# Altium schematic sheet IN-OUT.SchDoc
size A4
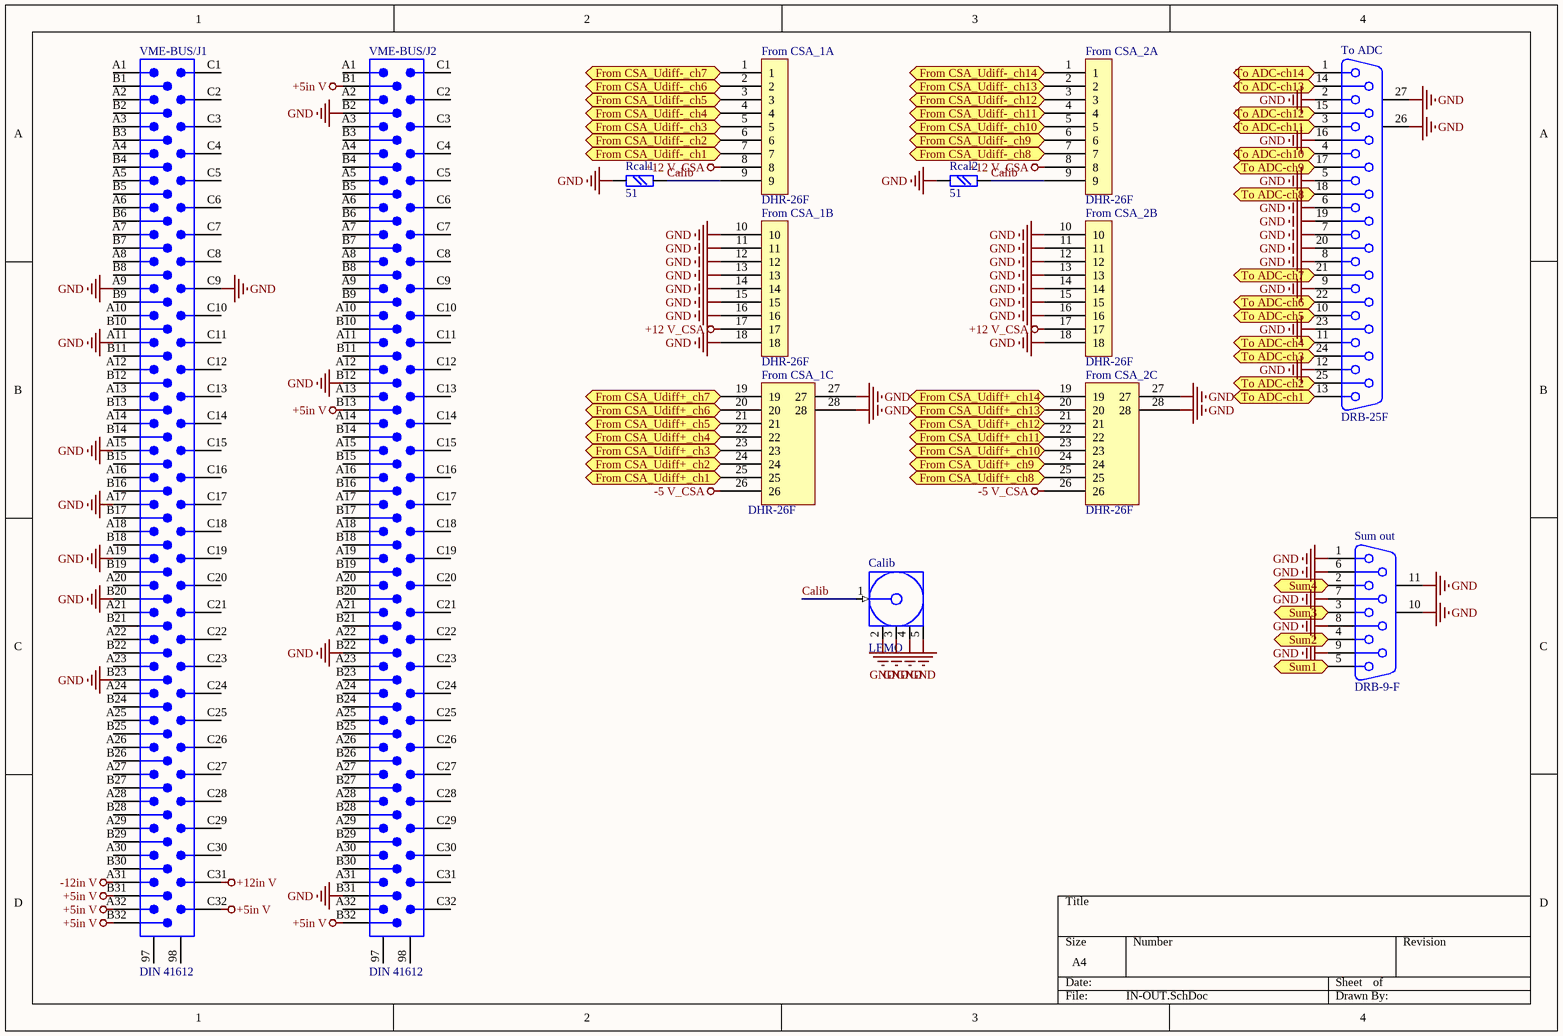
[diagram p0: IN-OUT.SchDoc]

## Parts
Calib  LEMO  [LEMO]
From_CSA_1  DHR-26F  [DHR-F-26]  (parts A,B,C of 3)
From_CSA_2  DHR-26F  [DHR-F-26]  (parts A,B,C of 3)
Rcal1  51  [chip0805]
Rcal2  51  [chip0805]
Sum_out  DRB-9-F  [DSUB1.385-2H9]
To_ADC  DRB-25F  [DSUB1.385-2H25A]
VME-BUS/J1  DIN 41612  [EURO2.54-2H96]
VME-BUS/J2  DIN 41612  [EURO2.54-2H96]

## Ports
From CSA_Udiff+_ch1 (in), From CSA_Udiff+_ch2 (in), From CSA_Udiff+_ch3 (in), From CSA_Udiff+_ch4 (in), From CSA_Udiff+_ch5 (in), From CSA_Udiff+_ch6 (in), From CSA_Udiff+_ch7 (in), From CSA_Udiff+_ch8 (in), From CSA_Udiff+_ch9 (in), From CSA_Udiff+_ch10 (in), From CSA_Udiff+_ch11 (in), From CSA_Udiff+_ch12 (in), From CSA_Udiff+_ch13 (in), From CSA_Udiff+_ch14 (in), From CSA_Udiff-_ch1 (in), From CSA_Udiff-_ch2 (in), From CSA_Udiff-_ch3 (in), From CSA_Udiff-_ch4 (in), From CSA_Udiff-_ch5 (in), From CSA_Udiff-_ch6 (in), From CSA_Udiff-_ch7 (in), From CSA_Udiff-_ch8 (in), From CSA_Udiff-_ch9 (in), From CSA_Udiff-_ch10 (in), From CSA_Udiff-_ch11 (in), From CSA_Udiff-_ch12 (in), From CSA_Udiff-_ch13 (in), From CSA_Udiff-_ch14 (in), Sum1 (in), Sum2 (in), Sum3 (in), Sum4 (in), To ADC-ch1 (in), To ADC-ch2 (in), To ADC-ch3 (in), To ADC-ch4 (in), To ADC-ch5 (in), To ADC-ch6 (in), To ADC-ch7 (in), To ADC-ch8 (in), To ADC-ch9 (in), To ADC-ch10 (in), To ADC-ch11 (in), To ADC-ch12 (in), To ADC-ch13 (in), To ADC-ch14 (in)

## Nets
+5in V: VME-BUS/J1.A32 VME-BUS/J1.B31 VME-BUS/J1.B32 VME-BUS/J1.C32 VME-BUS/J2.B1 VME-BUS/J2.B13 VME-BUS/J2.B32
+12 V_CSA: From_CSA_1.8 From_CSA_1.17 From_CSA_2.8 From_CSA_2.17
+12in V: VME-BUS/J1.C31
-5 V_CSA: From_CSA_1.26 From_CSA_2.26
-12in V: VME-BUS/J1.A31
GND: Calib.2(GND) Calib.3(GND) Calib.4(GND) Calib.5(GND) From_CSA_1.10 From_CSA_1.11 From_CSA_1.12 From_CSA_1.13 From_CSA_1.14 From_CSA_1.15 From_CSA_1.16 From_CSA_1.18 From_CSA_1.27 From_CSA_1.28 From_CSA_2.10 From_CSA_2.11 From_CSA_2.12 From_CSA_2.13 From_CSA_2.14 From_CSA_2.15 From_CSA_2.16 From_CSA_2.18 From_CSA_2.27 From_CSA_2.28 Rcal1.2 Rcal2.2 Sum_out.1 Sum_out.6 Sum_out.7 Sum_out.8 Sum_out.9 Sum_out.10(MH1) Sum_out.11(MH2) To_ADC.2 To_ADC.5 To_ADC.6 To_ADC.7 To_ADC.8 To_ADC.9 To_ADC.12 To_ADC.16 To_ADC.19 To_ADC.20 To_ADC.23 To_ADC.26(MH1) To_ADC.27(MH2) VME-BUS/J1.A9 VME-BUS/J1.A11 VME-BUS/J1.A15 VME-BUS/J1.A17 VME-BUS/J1.A19 VME-BUS/J1.B20 VME-BUS/J1.B23 VME-BUS/J1.C9 VME-BUS/J2.B2 VME-BUS/J2.B12 VME-BUS/J2.B22 VME-BUS/J2.B31
Calib: Calib.1(Signal) From_CSA_1.9 From_CSA_2.9 Rcal1.1 Rcal2.1
From CSA_Udiff+_ch1: From_CSA_1.25 ; port From CSA_Udiff+_ch1
From CSA_Udiff+_ch2: From_CSA_1.24 ; port From CSA_Udiff+_ch2
From CSA_Udiff+_ch3: From_CSA_1.23 ; port From CSA_Udiff+_ch3
From CSA_Udiff+_ch4: From_CSA_1.22 ; port From CSA_Udiff+_ch4
From CSA_Udiff+_ch5: From_CSA_1.21 ; port From CSA_Udiff+_ch5
From CSA_Udiff+_ch6: From_CSA_1.20 ; port From CSA_Udiff+_ch6
From CSA_Udiff+_ch7: From_CSA_1.19 ; port From CSA_Udiff+_ch7
From CSA_Udiff+_ch8: From_CSA_2.25 ; port From CSA_Udiff+_ch8
From CSA_Udiff+_ch9: From_CSA_2.24 ; port From CSA_Udiff+_ch9
From CSA_Udiff+_ch10: From_CSA_2.23 ; port From CSA_Udiff+_ch10
From CSA_Udiff+_ch11: From_CSA_2.22 ; port From CSA_Udiff+_ch11
From CSA_Udiff+_ch12: From_CSA_2.21 ; port From CSA_Udiff+_ch12
From CSA_Udiff+_ch13: From_CSA_2.20 ; port From CSA_Udiff+_ch13
From CSA_Udiff+_ch14: From_CSA_2.19 ; port From CSA_Udiff+_ch14
From CSA_Udiff-_ch1: From_CSA_1.7 ; port From CSA_Udiff-_ch1
From CSA_Udiff-_ch2: From_CSA_1.6 ; port From CSA_Udiff-_ch2
From CSA_Udiff-_ch3: From_CSA_1.5 ; port From CSA_Udiff-_ch3
From CSA_Udiff-_ch4: From_CSA_1.4 ; port From CSA_Udiff-_ch4
From CSA_Udiff-_ch5: From_CSA_1.3 ; port From CSA_Udiff-_ch5
From CSA_Udiff-_ch6: From_CSA_1.2 ; port From CSA_Udiff-_ch6
From CSA_Udiff-_ch7: From_CSA_1.1 ; port From CSA_Udiff-_ch7
From CSA_Udiff-_ch8: From_CSA_2.7 ; port From CSA_Udiff-_ch8
From CSA_Udiff-_ch9: From_CSA_2.6 ; port From CSA_Udiff-_ch9
From CSA_Udiff-_ch10: From_CSA_2.5 ; port From CSA_Udiff-_ch10
From CSA_Udiff-_ch11: From_CSA_2.4 ; port From CSA_Udiff-_ch11
From CSA_Udiff-_ch12: From_CSA_2.3 ; port From CSA_Udiff-_ch12
From CSA_Udiff-_ch13: From_CSA_2.2 ; port From CSA_Udiff-_ch13
From CSA_Udiff-_ch14: From_CSA_2.1 ; port From CSA_Udiff-_ch14
Sum1: Sum_out.5 ; port Sum1
Sum2: Sum_out.4 ; port Sum2
Sum3: Sum_out.3 ; port Sum3
Sum4: Sum_out.2 ; port Sum4
To ADC-ch1: To_ADC.13 ; port To ADC-ch1
To ADC-ch2: To_ADC.25 ; port To ADC-ch2
To ADC-ch3: To_ADC.24 ; port To ADC-ch3
To ADC-ch4: To_ADC.11 ; port To ADC-ch4
To ADC-ch5: To_ADC.10 ; port To ADC-ch5
To ADC-ch6: To_ADC.22 ; port To ADC-ch6
To ADC-ch7: To_ADC.21 ; port To ADC-ch7
To ADC-ch8: To_ADC.18 ; port To ADC-ch8
To ADC-ch9: To_ADC.17 ; port To ADC-ch9
To ADC-ch10: To_ADC.4 ; port To ADC-ch10
To ADC-ch11: To_ADC.3 ; port To ADC-ch11
To ADC-ch12: To_ADC.15 ; port To ADC-ch12
To ADC-ch13: To_ADC.14 ; port To ADC-ch13
To ADC-ch14: To_ADC.1 ; port To ADC-ch14

Not connected (* = marked no-connect by the designer): VME-BUS/J1 97 98 A1 A2 A3 A4 A5 A6 A7 A8 A10 A12 A13 A14 A16 A18 A20 A21 A22 A23 A24 A25 A26 A27 A28 A29 A30 B1 B2 B3 B4 B5 B6 B7 B8 B9 B10 B11 B12 B13 B14 B15 B16 B17 B18 B19 B21 B22 B24 B25 B26 B27 B28 B29 B30 C1 C2 C3 C4 C5 C6 C7 C8 C10 C11 C12 C13 C14 C15 C16 C17 C18 C19 C20 C21 C22 C23 C24 C25 C26 C27 C28 C29 C30; VME-BUS/J2 97 98 A1 A2 A3 A4 A5 A6 A7 A8 A9 A10 A11 A12 A13 A14 A15 A16 A17 A18 A19 A20 A21 A22 A23 A24 A25 A26 A27 A28 A29 A30 A31 A32 B3 B4 B5 B6 B7 B8 B9 B10 B11 B14 B15 B16 B17 B18 B19 B20 B21 B23 B24 B25 B26 B27 B28 B29 B30 C1 C2 C3 C4 C5 C6 C7 C8 C9 C10 C11 C12 C13 C14 C15 C16 C17 C18 C19 C20 C21 C22 C23 C24 C25 C26 C27 C28 C29 C30 C31 C32

## Library data of the parts
Calib = COAX-F: RF Coaxial PCB Connector, MCX; Thru-Hole, Right-Angle Mount Socket, Blunt Post Terminal, 50 Ohm Impedance; PCB_Layout: Complies with manufacturer's recommendation.; DrillSize: Corresponds to nominal value.; Published: 15-Jul-2004; LatestRevisionDate: 15-Jul-2004; LatestRevisionNote: Component Replaced.; DatasheetDocument: 30-May-2003; PackageDocument: 04-Jul-1999; PackageReference: 919-119J-51AX; Publisher: Altium Limited; ComponentLink1Description: Manufacturer Link; ComponentLink1URL: http://www.amphenolrf.com/
Rcal1 Rcal2 = R: Text Field1: 20; Text Field2: 20
Sum_out = D Connector 9: Receptacle Assembly, 9 Position, Right Angle; PackageDocument: O; Positions: 9; Published: 15-Jun-2001; LatestRevisionDate: 17-Jul-2002; LatestRevisionNote: Re-released for DXP Platform.; DatasheetDocument: 1-Sep-1999; PackageReference: 788750; Publisher: Altium Limited; Orientation: Right Angle; Gender: Receptacle
To_ADC = D Connector 25: Receptacle Assembly, 25 Position, Right Angle; PackageDocument: U; Positions: 25; Published: 15-Jun-2001; LatestRevisionDate: 17-Jul-2002; LatestRevisionNote: Re-released for DXP Platform.; DatasheetDocument: 19-Mar-1999; PackageReference: 787202; Publisher: Altium Limited; Orientation: Right Angle; Gender: Receptacle
VME-BUS/J1 VME-BUS/J2 = CNVME96: 96-Pin Connector (3x32 2.54mm grid); Text Field6: Alternate Layout Available; Text Field7: Published 14-Feb-2002